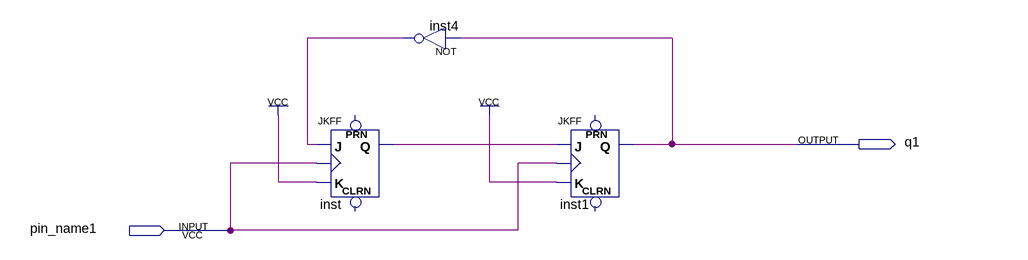
[diagram p0: schematic sheet]
// Quartus schematic numarator3.bdf as structural Verilog: 3 symbols, 2 pins
module numarator3 (
  input  pin_name1,
  output q1
);

  wire inst4_out, inst_q;

  JKFF inst (.K(1'b1), .J(inst4_out), .CLK(pin_name1), .Q(inst_q));  // open: PRN, CLRN
  not inst4 (inst4_out, q1);
  JKFF inst1 (.K(1'b1), .J(inst_q), .CLK(pin_name1), .Q(q1));  // open: PRN, CLRN
endmodule
